# EasyEDA schematic G1000_Buttons_Left.json
TITLE: Sheet_1; REV: 1.0; Date: 2024-03-31; Sheet: 1/1; Drawn By: gagagu1; Company: Your Company
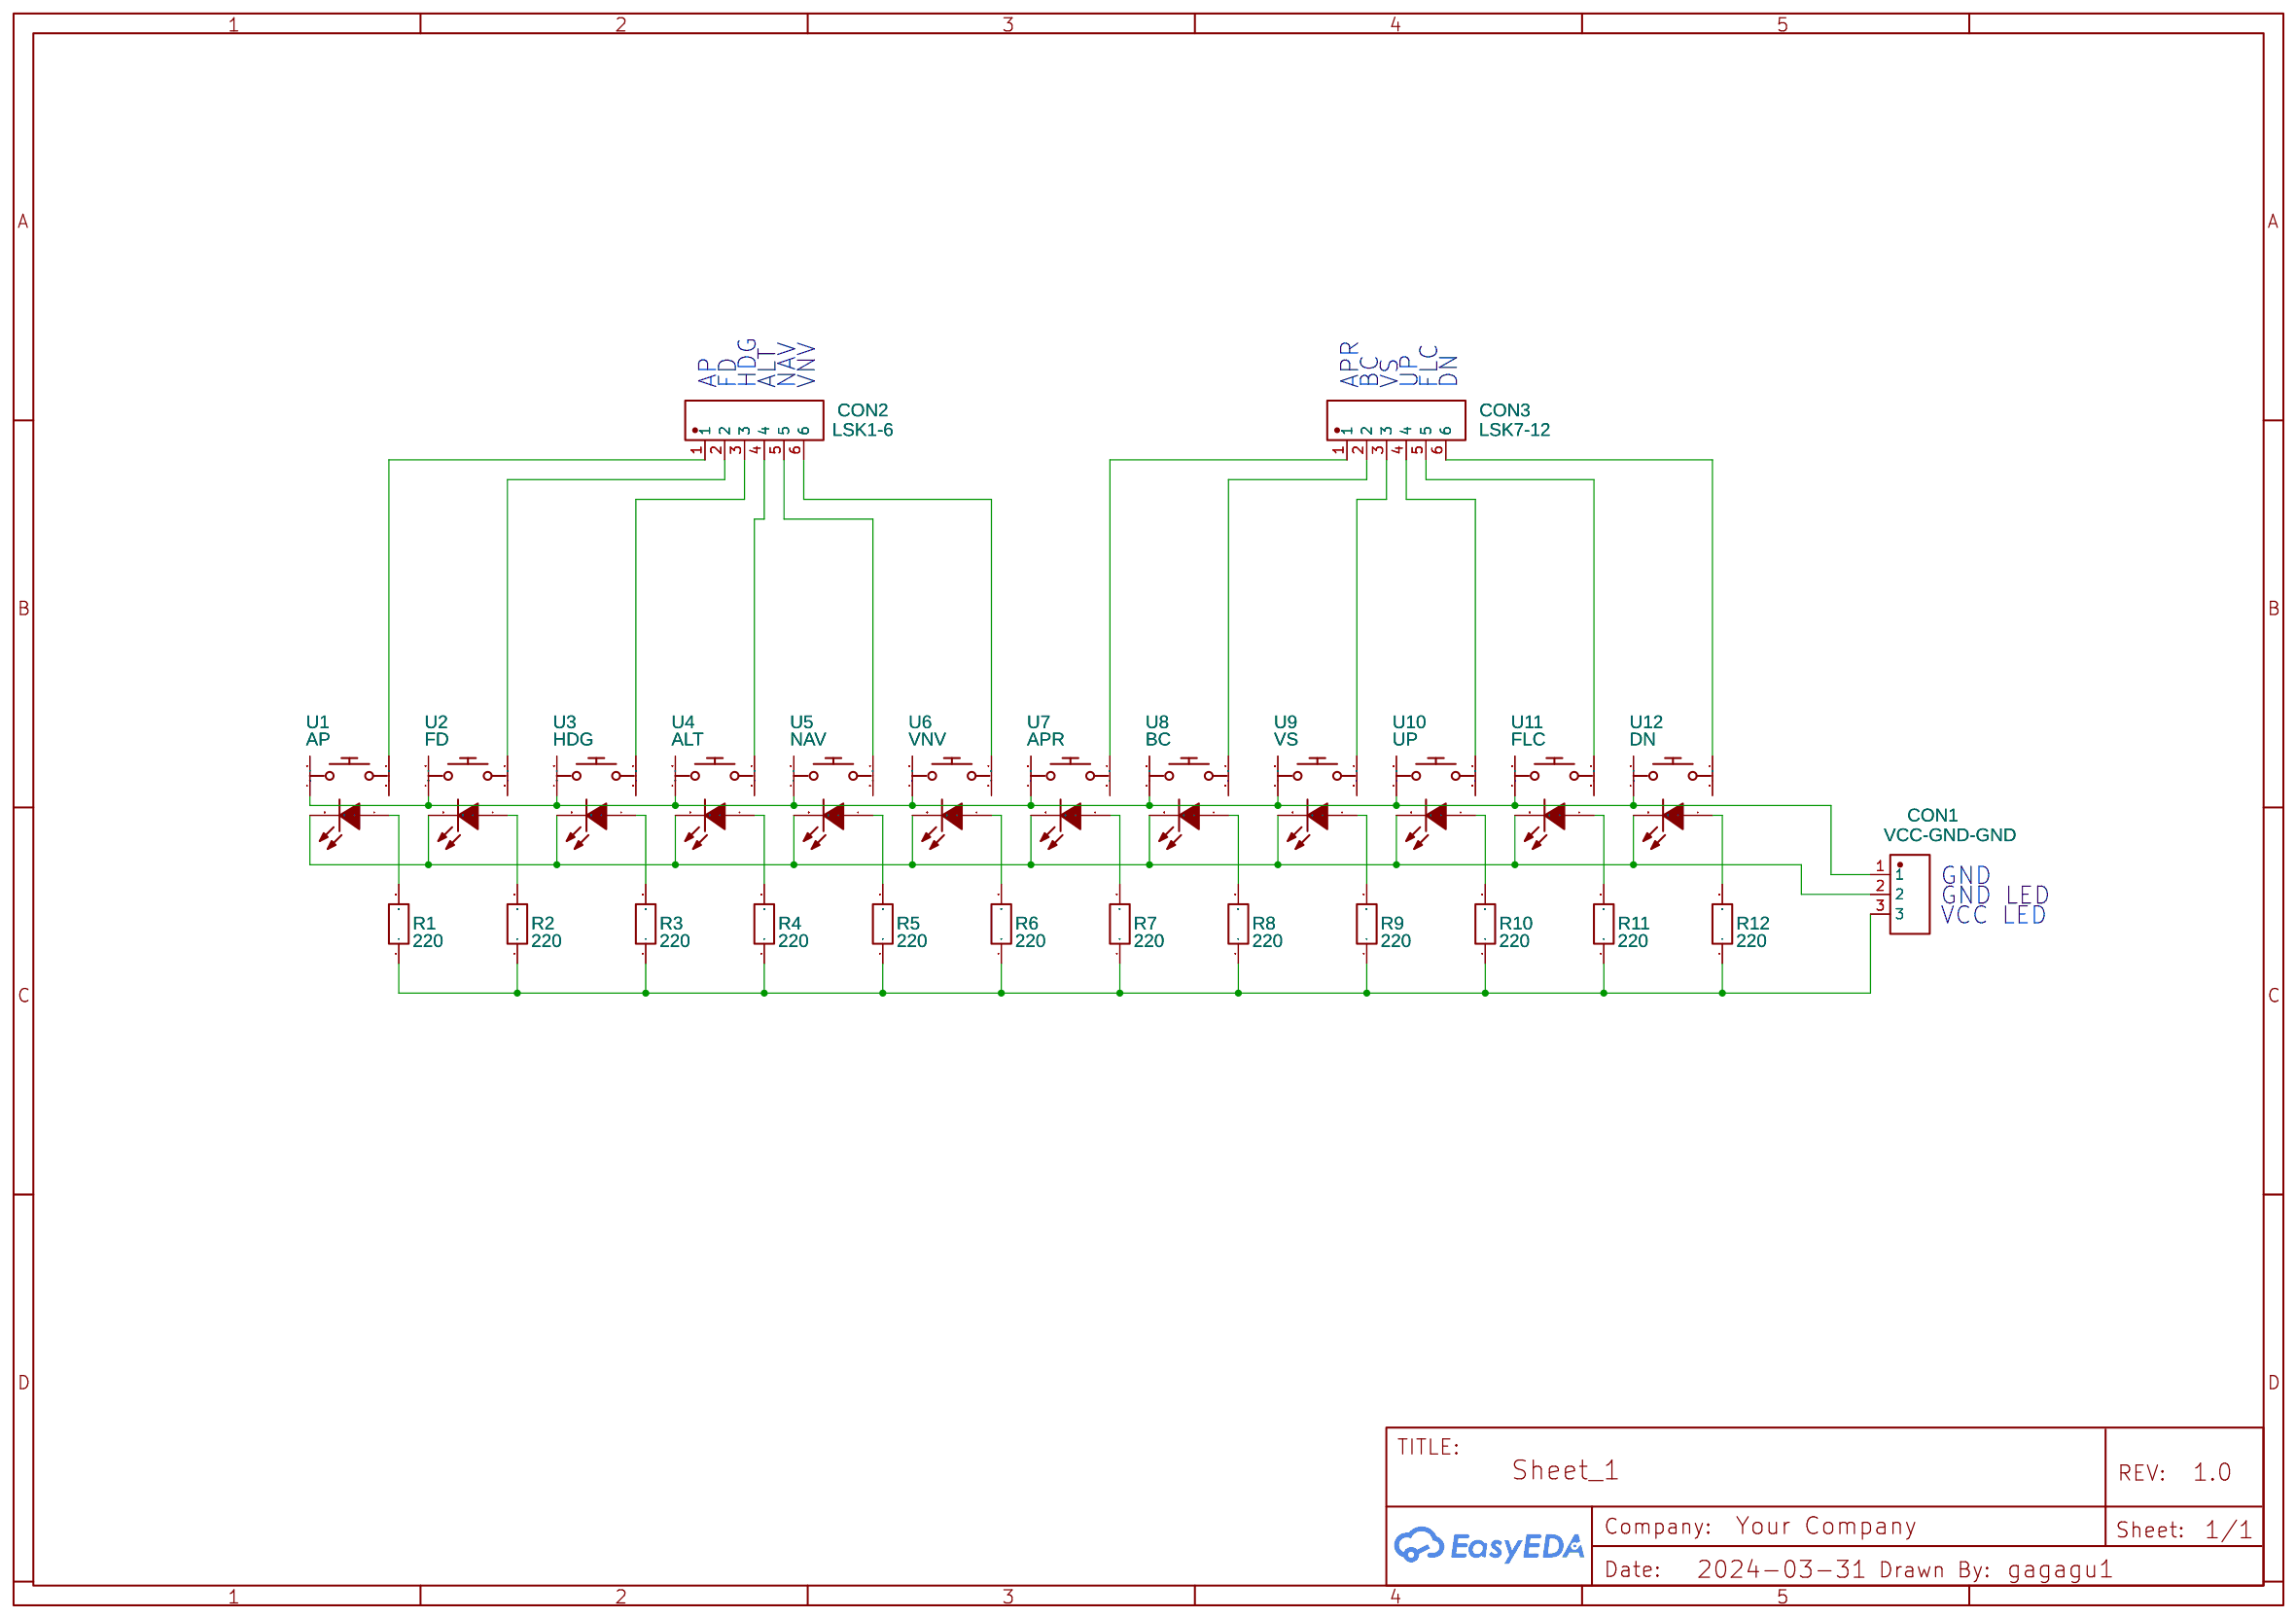
[diagram p0: schematic sheet]

## Parts
CON1  VCC-GND-GND  [CONN-TH_3P-P2.50_HC-XH-3A-G]
CON2  LSK1-6  [ARUN-CONN-TH_XH-6A]
CON3  LSK7-12  [ARUN-CONN-TH_XH-6A]
R1  220  [R_AXIAL-0.4]
R2  220  [R_AXIAL-0.4]
R3  220  [R_AXIAL-0.4]
R4  220  [R_AXIAL-0.4]
R5  220  [R_AXIAL-0.4]
R6  220  [R_AXIAL-0.4]
R7  220  [R_AXIAL-0.4]
R8  220  [R_AXIAL-0.4]
R9  220  [R_AXIAL-0.4]
R10  220  [R_AXIAL-0.4]
R11  220  [R_AXIAL-0.4]
R12  220  [R_AXIAL-0.4]
U1  AP  [6X6_LED+PUSHBUTTON]
U2  FD  [6X6_LED+PUSHBUTTON]
U3  HDG  [6X6_LED+PUSHBUTTON]
U4  ALT  [6X6_LED+PUSHBUTTON]
U5  NAV  [6X6_LED+PUSHBUTTON]
U6  VNV  [6X6_LED+PUSHBUTTON]
U7  APR  [6X6_LED+PUSHBUTTON]
U8  BC  [6X6_LED+PUSHBUTTON]
U9  VS  [6X6_LED+PUSHBUTTON]
U10  UP  [6X6_LED+PUSHBUTTON]
U11  FLC  [6X6_LED+PUSHBUTTON]
U12  DN  [6X6_LED+PUSHBUTTON]

## Library data of the parts
CON1 = HC-XH-3A-G: Contributor: Мэтт Милер; Supplier: LCSC; Supplier Part: C5341202; Manufacturer: HCTL(华灿天禄); JLCPCB Part Class: Extended Part
CON2 CON3 = ARUN-CONN-TH_XH-6A: Supplier: LCSC; Supplier Part: C722879; Manufacturer: CAX; Manufacturer Part: XH-6A; Contributor: LCSC; JLCPCB Part Class: Extended Part
R1-R12 = R_AXIAL-0.4_EU: Contributor: LCEDA_Lib
U1-U12 = 6X6_LED+PUSHBUTTON V2: sourceId: 5viSsqoYV; Contributor: Aleix Ferrero

## Nets
Net-(CON1-1): CON1.1 U1.4 U2.4 U3.4 U4.4 U5.4 U6.4 U7.4 U8.4 U9.4 U10.4 U11.4 U12.4
Net-(CON1-2): CON1.2 U1.C U2.C U3.C U4.C U5.C U6.C U7.C U8.C U9.C U10.C U11.C U12.C
Net-(CON1-3): CON1.3 R1.1 R2.1 R3.1 R4.1 R5.1 R6.1 R7.1 R8.1 R9.1 R10.1 R11.1 R12.1
Net-(CON2-1): CON2.1 U1.1
Net-(CON2-2): CON2.2 U2.1
Net-(CON2-3): CON2.3 U3.1
Net-(CON2-4): CON2.4 U4.1
Net-(CON2-5): CON2.5 U5.1
Net-(CON2-6): CON2.6 U6.1
Net-(CON3-1): CON3.1 U7.1
Net-(CON3-2): CON3.2 U8.1
Net-(CON3-3): CON3.3 U9.1
Net-(CON3-4): CON3.4 U10.1
Net-(CON3-5): CON3.5 U11.1
Net-(CON3-6): CON3.6 U12.1
Net-(R1-2): R1.2 U1.A
Net-(R2-2): R2.2 U2.A
Net-(R3-2): R3.2 U3.A
Net-(R4-2): R4.2 U4.A
Net-(R5-2): R5.2 U5.A
Net-(R6-2): R6.2 U6.A
Net-(R7-2): R7.2 U7.A
Net-(R8-2): R8.2 U8.A
Net-(R9-2): R9.2 U9.A
Net-(R10-2): R10.2 U10.A
Net-(R11-2): R11.2 U11.A
Net-(R12-2): R12.2 U12.A

Not connected (* = marked no-connect by the designer): U1 2 3; U2 2 3; U3 2 3; U4 2 3; U5 2 3; U6 2 3; U7 2 3; U8 2 3; U9 2 3; U10 2 3; U11 2 3; U12 2 3

## Notes on the sheet
- AP
- FD
- HDG
- ALT
- NAV
- VNV
- APR
- BC
- VS
- UP
- FLC
- DN
- GND
- GND LED
- VCC LED
